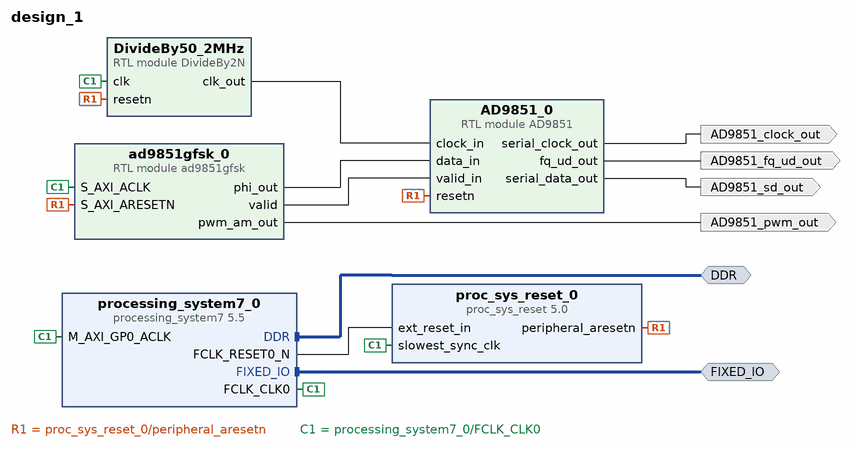
[diagram p0: block diagram of the top level]
# Vivado block design design_1, xc7z010clg400-1, Vivado 2022.2
create_bd_design design_1

create_bd_intf_port -mode Master -vlnv xilinx.com:interface:ddrx_rtl:1.0 DDR
create_bd_intf_port -mode Master -vlnv xilinx.com:display_processing_system7:fixedio_rtl:1.0 FIXED_IO
create_bd_port -dir O AD9851_pwm_out
create_bd_port -dir O AD9851_sd_out
create_bd_port -dir O AD9851_clock_out
create_bd_port -dir O AD9851_fq_ud_out

create_bd_cell -type ip -vlnv xilinx.com:ip:processing_system7:5.5 processing_system7_0
set_property -dict {CONFIG.PCW_FPGA0_PERIPHERAL_FREQMHZ 100} [get_bd_cells processing_system7_0]
# 30 more settings of processing_system7_0 are not shown: defaults, MIO pin electricals, DDR timing, and values the tool derives
create_bd_cell -type ip -vlnv xilinx.com:ip:proc_sys_reset:5.0 proc_sys_reset_0
create_bd_cell -type module -reference AD9851 AD9851_0
create_bd_cell -type module -reference DivideBy2N DivideBy50_2MHz
set_property -dict {CONFIG.N 25 CONFIG.WIDTH 5} [get_bd_cells DivideBy50_2MHz]
create_bd_cell -type module -reference ad9851gfsk ad9851gfsk_0
set_property -dict {CONFIG.demo_mode {"1"}} [get_bd_cells ad9851gfsk_0]

# ---- connections ----

connect_bd_intf_net [get_bd_intf_ports DDR] [get_bd_intf_pins processing_system7_0/DDR]
connect_bd_intf_net [get_bd_intf_ports FIXED_IO] [get_bd_intf_pins processing_system7_0/FIXED_IO]
connect_bd_net [get_bd_pins AD9851_0/fq_ud_out] [get_bd_ports AD9851_fq_ud_out]
connect_bd_net [get_bd_pins AD9851_0/serial_clock_out] [get_bd_ports AD9851_clock_out]
connect_bd_net [get_bd_pins AD9851_0/serial_data_out] [get_bd_ports AD9851_sd_out]
connect_bd_net [get_bd_pins DivideBy50_2MHz/clk_out] [get_bd_pins AD9851_0/clock_in]
connect_bd_net [get_bd_pins proc_sys_reset_0/peripheral_aresetn] \
  [get_bd_pins DivideBy50_2MHz/resetn] [get_bd_pins AD9851_0/resetn] [get_bd_pins ad9851gfsk_0/S_AXI_ARESETN]
connect_bd_net [get_bd_pins ad9851gfsk_0/phi_out] [get_bd_pins AD9851_0/data_in]
connect_bd_net [get_bd_pins ad9851gfsk_0/pwm_am_out] [get_bd_ports AD9851_pwm_out]
connect_bd_net [get_bd_pins ad9851gfsk_0/valid] [get_bd_pins AD9851_0/valid_in]
connect_bd_net [get_bd_pins processing_system7_0/FCLK_CLK0] \
  [get_bd_pins proc_sys_reset_0/slowest_sync_clk] [get_bd_pins processing_system7_0/M_AXI_GP0_ACLK] \
  [get_bd_pins DivideBy50_2MHz/clk] [get_bd_pins ad9851gfsk_0/S_AXI_ACLK]
connect_bd_net [get_bd_pins processing_system7_0/FCLK_RESET0_N] [get_bd_pins proc_sys_reset_0/ext_reset_in]

validate_bd_design
save_bd_design
